# EAGLE design weaver_4pin_merger (EAGLE 7.4.0)
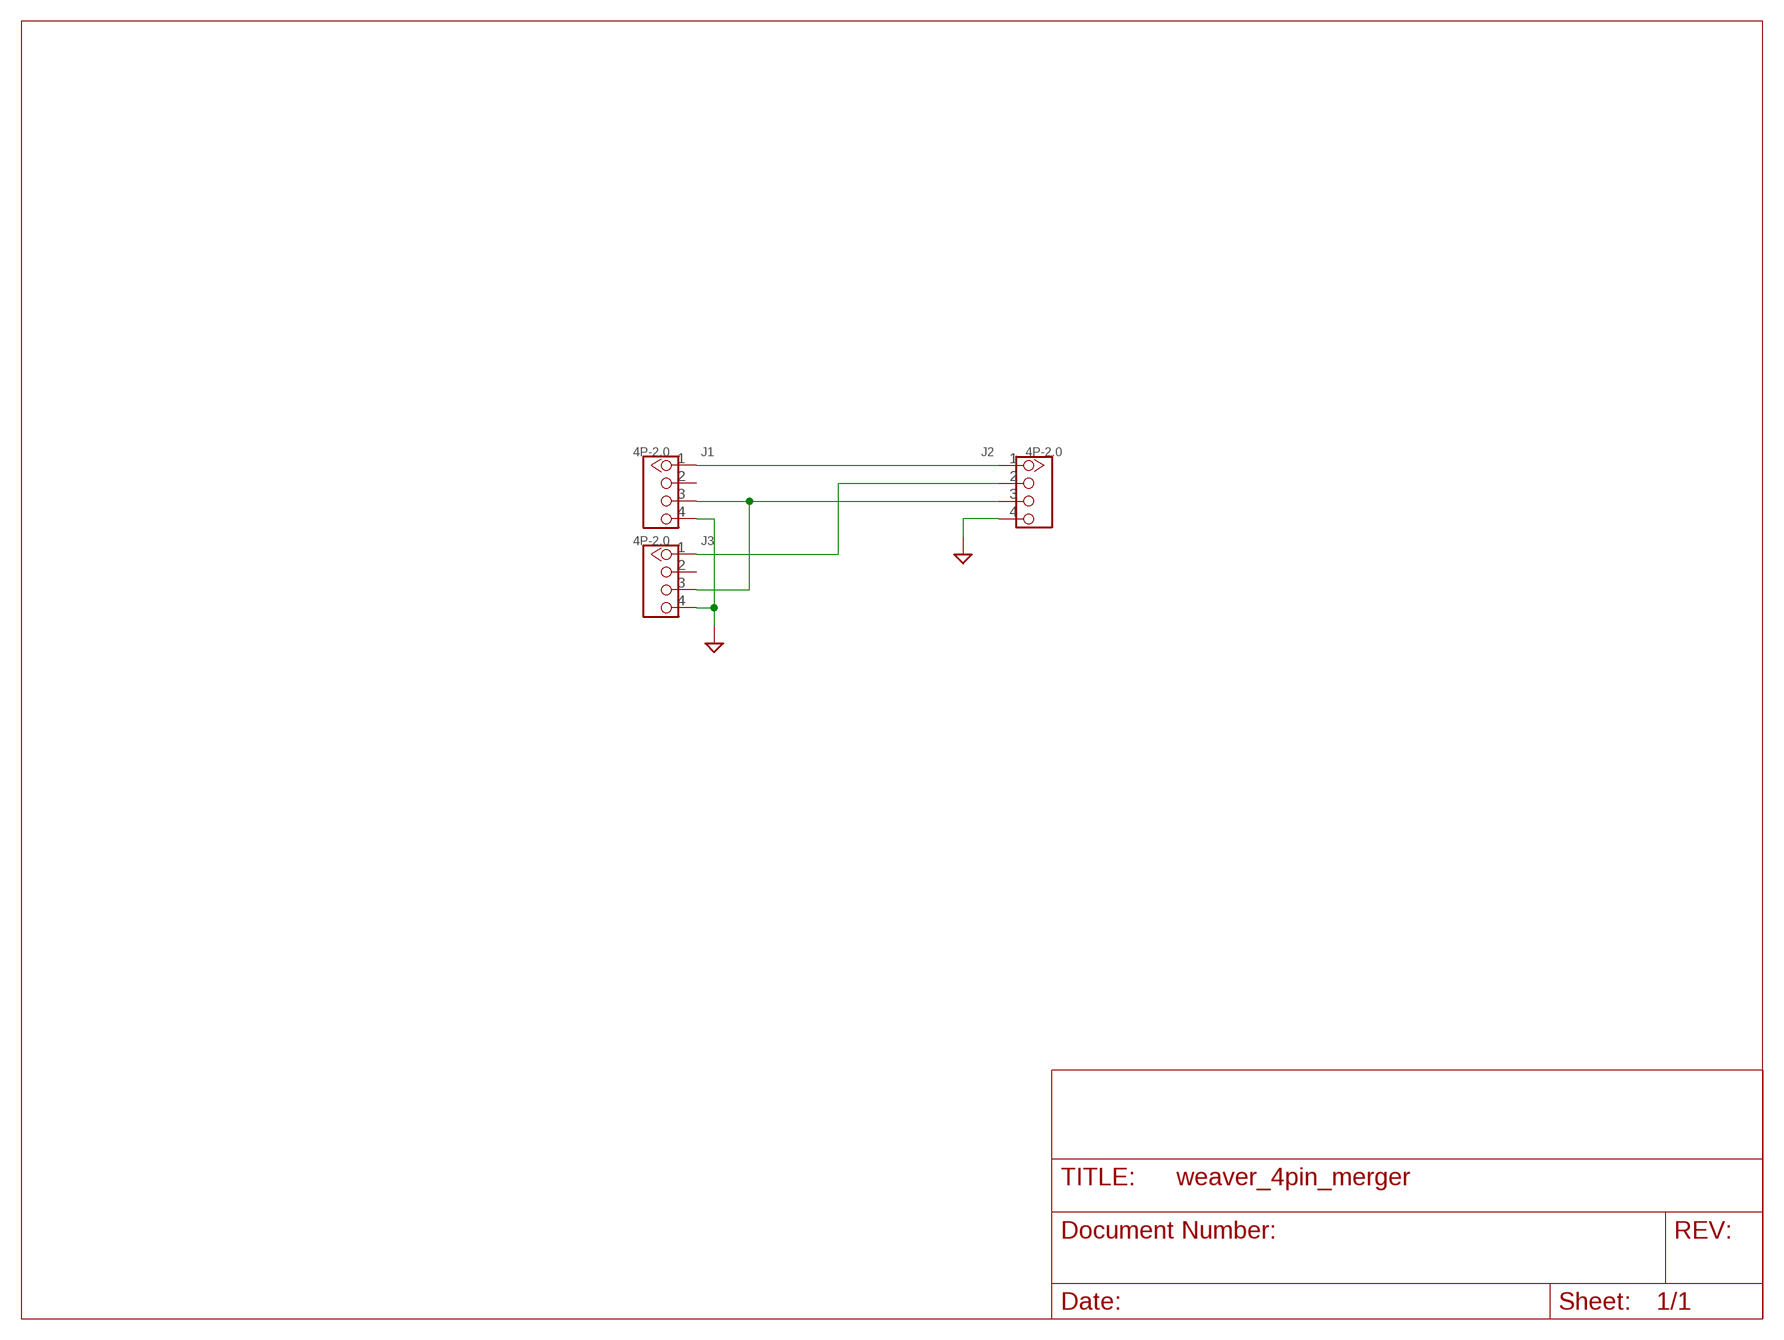
[diagram p0: schematic, sheet 1]

## Parts
J1  4P-2.0  GROVE-CONNECTOR-DIP(4P-2.0)  [HW4-2.0]
J2  4P-2.0  GROVE-CONNECTOR-DIP(4P-2.0)  [HW4-2.0]
J3  4P-2.0  GROVE-CONNECTOR-DIP(4P-2.0)  [HW4-2.0]

## Nets
GND: J1.4 J2.4 J3.4
N$1: J1.1 J2.1
N$2: J2.2 J3.1
N$4: J1.3 J2.3 J3.3
Unconnected: J1.2 J3.2

## Library data of the parts
J1-J3 = NanoPlaygroundFace:GROVE-CONNECTOR-DIP(4P-2.0): 320110033

## Net classes
0 default: width 0.305 mm, drill 0.508 mm, clearance 0.254 mm

## Board
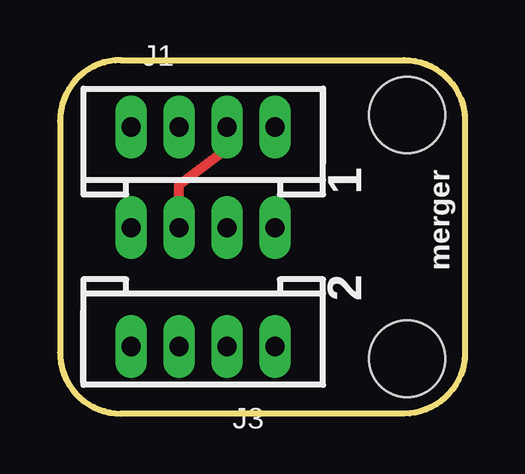
[diagram p1: board, top side]
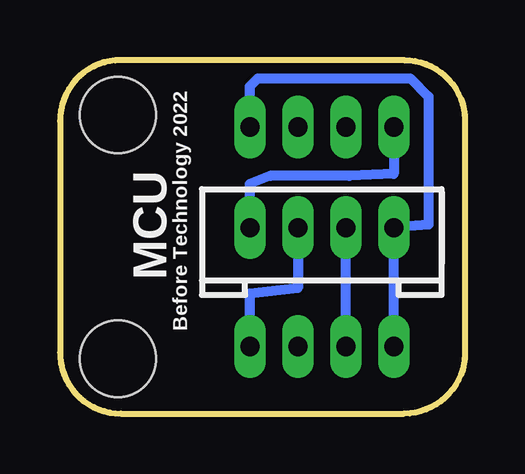
[diagram p2: board, bottom side, seen from below]

Size 16.89 x 14.73 mm. Coordinates in mm from the lower left corner, seen from the top.
Outline: 0,12.19 0,2.54 arc90 2.54,0 14.35,0 arc90 16.89,2.54 16.89,12.19 arc90 14.35,14.73 2.54,14.73 arc90 0,12.19
Copper layers (1*16): Top 0.035mm / dielectric 1.5mm / Bottom 0.035mm
Design rules "default *": minimum track width 10mil, minimum drill 20mil, track to track 8mil, track to pad 8mil, pad to pad 8mil, via to via 8mil, smd to smd 8mil, copper to edge 40mil, drill to drill 8mil, minimum pad ring 10mil, minimum via ring 8mil, stop-mask expansion 4mil, vias tented up to drill 0mil, thermal gap 10mil
Holes 3.17 mm at 14.48,12.45 14.48,2.29

### Footprints (pad centres in the part's own frame; a part is rotated, then mirrored left to right if it is on the bottom)
HW4-2.0 = drill 0.8 pad 1.27 long: 1 -3,0; 2 -1,0; 3 1,0; 4 3,0

### Placement (x,y rotation side)
J1  5.97,11.94 0 top
J2  5.97,7.75 0 bottom
J3  5.97,2.79 180 top

### Tracks (layer width: path | path; a pad name or v marks a point on that pad's centre or on a via)
GND
  Bottom 0.406: J3.4 J2.4 3.17,7.75 1.52,7.87 1.52,13.21 2.29,13.97 8.64,13.97 8.97,13.64 J1.4
N$1
  Bottom 0.406: J1.1 2.97,9.99 4.83,9.91 8.13,9.91 8.97,9.57 J2.1
N$2
  Bottom 0.406: J2.2 6.97,5.22 8.97,5 J3.1
N$4
  Top 0.406: J2.3 4.97,9.54 6.97,11.03 J1.3
  Bottom 0.406: J3.3 J2.3

### Text on the board
tPlace: 1 | merger | 2
bPlace: Before Technology 2022 | MCU